# Altium schematic sheet CAN_Interface.SchDoc
size 431 x 279 mm; Organization: ORGANIZATION; Address1: ADDRESS 1; Address2: ADDRESS 2; Address3: ADDRESS 3; Address4: ADDRESS 4; Revision: -; SheetNumber: 2; SheetTotal: 5; ENG_APP_DATE: --/--/--; DSN_APP_DATE: --/--/--; CHK_APP_DATE: --/--/--
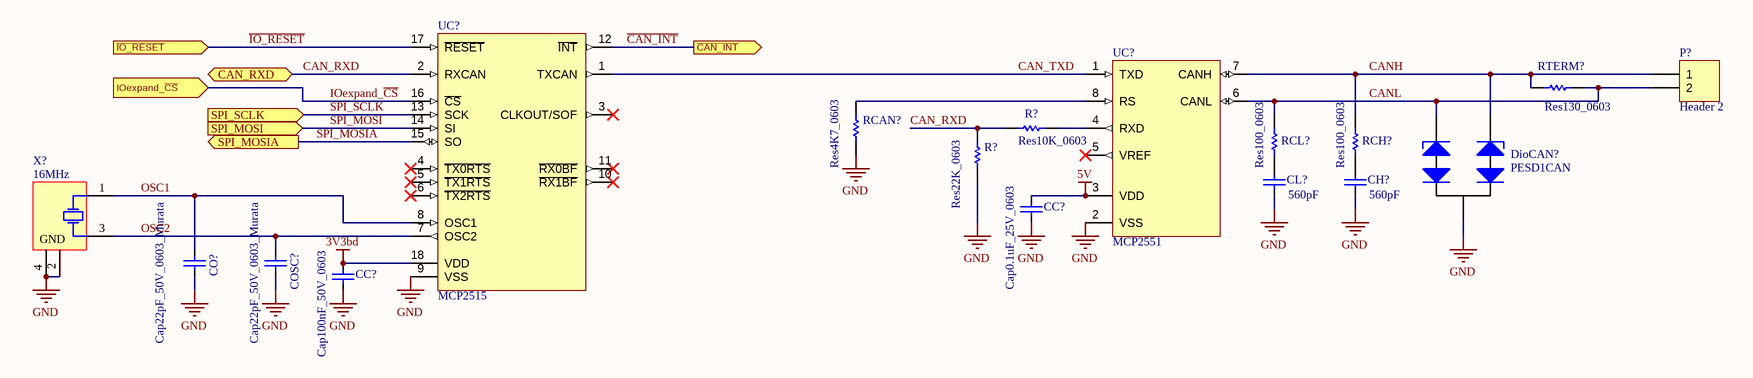
[diagram p0: CAN_Interface.SchDoc]

## Parts
(Parts that share a designator on the sheet are numbered #1, #2 ... from top to bottom, then left to right.)
CC?#1  Cap0.1uF_25V_0603  [0603C_L]
CC?#2  Cap100nF_50V_0603  [0603C_L]
CH?  value 560pF  [0603C_L]  (hidden comment: CAP General)
CL?  value 560pF  [0603C_L]  (hidden comment: CAP General)
CO?  Cap22pF_50V_0603_Murata  [0603C_L]
COSC?  Cap22pF_50V_0603_Murata  [0603C_L]
DioCAN?  PESD1CAN  [SOT323]
P?  Header 2  [HDR1X2]
R?#1  Res10K_0603  [0603_L]
R?#2  Res22K_0603  [0603_L]
RCAN?  Res4K7_0603  [0603_L]
RCH?  Res100_0603  [0603_L]
RCL?  Res100_0603  [0603_L]
RTERM?  Res130_0603  [0603_L]
UC?#1  MCP2515  [SOIC-SO18_M]
UC?#2  MCP2551  [SOIC-SN8_N]
X?  Frequency: 16MHz  [FP-ABM8-MFG]  (hidden comment: Crystal 4Pin)

## Ports
CAN_RXD (bidir), IOexpand_~{CS} (in), SPI_MOSI (in), SPI_MOSIA (out), SPI_SCLK (in), ~{CAN_INT} (out), ~{IO_RESET} (in)

## Nets
3V3bd: CC?#2.2 UC?#1.18(VDD)
5V: CC?#1.2 UC?#2.3(VDD)
GND: CC?#1.1 CC?#2.1 CH?.2 CL?.1 CO?.1 COSC?.1 DioCAN?.3 R?#2.1 RCAN?.1 UC?#1.9(VSS) UC?#2.2(VSS) X?.2(GND) X?.4(GND)
~{CAN_INT}: UC?#1.12(~{INT}) ; port ~{CAN_INT}
~{IO_RESET}: UC?#1.17(~{RESET}) ; port ~{IO_RESET}
CAN_RXD: R?#1.2 R?#2.2 UC?#1.2(RXCAN) ; port CAN_RXD
CAN_TXD: UC?#1.1(TXCAN) UC?#2.1(TXD)
CANH: DioCAN?.1(A) P?.1 RCH?.2 RTERM?.2 UC?#2.7(CANH)
CANL: DioCAN?.2(K) P?.2 RCL?.2 RTERM?.1 UC?#2.6(CANL)
IOexpand_~{CS}: UC?#1.16(~{CS}) ; port IOexpand_~{CS}
OSC1: CO?.2 UC?#1.8(OSC1) X?.1
OSC2: COSC?.2 UC?#1.7(OSC2) X?.3
SPI_MOSI: UC?#1.14(SI) ; port SPI_MOSI
SPI_MOSIA: UC?#1.15(SO) ; port SPI_MOSIA
SPI_SCLK: UC?#1.13(SCK) ; port SPI_SCLK
NetCH?_1: CH?.1 RCH?.1
NetCL?_2: CL?.2 RCL?.1
NetR?#1_1: R?#1.1 UC?#2.4(RXD)
NetRCAN?_2: RCAN?.2 UC?#2.8(RS)

Not connected (* = marked no-connect by the designer): UC?#1 3(CLKOUT/SOF)* 4(~{TX0RTS})* 5(~{TX1RTS})* 6(~{TX2RTS})* 10(~{RX1BF})* 11(~{RX0BF})*; UC?#2 5(VREF)*

## Notes on the sheet
- DWG. NO.
- REV.
- SHT.
- THIS DOCUMENT AND THE DATA DISCLOSED HEREIN OR HEREWITH IS THE PROPERTY OF ALTIUM LIMITED AND MAY BE FREELY DISTRIBUTED IN WHOLE. NO RIGHTS ARE RESERVED OR EXPRESS OR IMPLIED WARANTEE GIVEN.
- REVISION
- DESCRIPTION
- DATE
- APPROVED
- ENG:
- DSN:
- APPROVALS
- PROJECT REVISION:
- www.altium.com <http://www.altium.com>
- DOCUMENT REVISION:
- 92037, La Jolla
- USA
- Altium Ltd.
- 4225 Executive Square
- CHK:
- REFERENCE DOCUMENTS
- DESIGN ITEM:
- TITLE
- VARIANT
- BOM:
- FAB DWG:
- PCB DWG:
- ASSY DWG:
- SCALE:
- SIZE
- B
- CAGE CODE
- FILE NAME
- DWG NO.
- SHEET
- OF
- REV

## Library data of the parts
CC?#1 = CMP-00001-1: Value: 100nF; Voltage Rating: 25V; Case/Package: 0603
CC?#2 = CMP-00119-2: Ceramic Capacitor, Multilayer, Ceramic, 50V, 80% +Tol, 20% -Tol, Y5V, -82/+22% TC, 0.1uF, Surface Mount, 0603; Value: 100nF; Multilayer: Yes; Case/Package: 0603; Dielectric Material: Ceramic; Height: 0.8mm; Length: 1.6mm; Max Operating Temperature: 85°C; Min Operating Temperature: -30°C; Mounting Technology: Surface Mount; Packaging: Tape and Reel; Pins: 2; RoHS Compliant: Yes; Termination: Wraparound; Voltage Rating: 50V; Width: 0.8mm; Capacitor Type: Ceramic; JESD-609 Code: e3; Package Shape: Rectangular; Package Style: SMTMeter; Rated DC Voltage (URdc): 50V; Reach SVHC Compliant: Yes; Temperature Characteristics Code: Y5V; Terminal Finish: Nickel; Tolerance  (fill in as +-): 20%; Tolerance (fill in as +-): 80%
CH? CL? = CMP-00212-1: 560pF 25V 0603; Case/Package: 0603; Voltage Rating: 25V
CO? COSC? = CMP-00026-1: Ceramic Capacitor, Multilayer, Ceramic, 50V, 5% +Tol, 5% -Tol, C0G, 30ppm/Cel TC, 0.000022uF, Surface Mount, 0603; Value: 22pF; Multilayer: Yes; Case/Package: 0603; Pins: 2; Min Operating Temperature: -55°C; Max Operating Temperature: 125°C; Voltage Rating: 50V; Tolerance: 5%; Packaging: Tape and Reel; Length: 1.6mm; Height: 0.8mm; Width: 0.8mm; Dielectric Material: Ceramic; Mounting Technology: Surface Mount; RoHS Compliant: Yes; Termination: Wraparound; Capacitor Type: Ceramic; JESD-609 Code: e3; Package Shape: Rectangular; Package Style: SMTMeter; Rated DC Voltage (URdc): 50V; Reach SVHC Compliant: Yes; Temperature Characteristics Code: C0G; Terminal Finish: Nickel; Tolerance  (fill in as +-): 5%; Tolerance (fill in as +-): 5%
DioCAN? = CMP-00244-2: Trans Voltage Suppressor Diode, 150W, 24V V(RWM), Bidirectional, 2 Element, Silicon; Manufacturer: Nexperia USA Inc.; Diode Type: Fast Recovery; Design Item ID: PESD1CAN-UX; Source: WCT.SchLib
P? = CMP-00146-1: Header, 2-Pin; LatestRevisionDate: 17-Jul-2002; LatestRevisionNote: Re-released for DXP Platform.; Publisher: Altium Limited; Design Item ID: Header 2; Source: WCT.SchLib
R?#1 = CMP-00098-1: Manufacturer: Panasonic Electronic Components; Manufacturer Part Number: ERJ-3GEYJ102V; Resistance (Ohms): 10k; Tolerance: 5%; Power (Watts): 0.1W, 1/10W; Temperature Coefficient: ±200ppm/°C; RoHS: RoHS Compliant; Category: Resistors; Packaging: Cut Tape (CT); Part Status: Active; Composition: Thick Film; Features: Automotive AEC-Q200; Operating Temperature: -55°C ~ 155°C; Package / Case: 0603 (1608 Metric); Supplier Device Package: 0603; Size / Dimension: 0.063" L x 0.031" W (1.60mm x 0.80mm); Height: 0.022" (0.55mm); Number of Terminations: 2; Failure Rate: -; Design Item ID: Res10K_0603; Source: WCT.SchLib
R?#2 = CMP-00013-1: RES22K 0.5% 0603; Manufacturer: Yageo; Manufacturer Part Number: RT0603DRD0722KL; Power Rating: 100 mW; Temperature Coefficient: 25 PPM / C; Voltage Rating: 75V; Unit Weight: 0.000071 oz; Value: 22k; Stock 1: 39729; Pricing 1: 1=0.12, 10=0.104, 25=0.0716, 50=0.0558, 100=0.0399, 250=0.0311, 500=0.0247, 1000=0.0175 (USD); Product Category: Thin Film Resistors - SMD; RoHS: True; Tolerance: 0.5%; Case Code - mm: 1608; Operating Temperature Range: - 55 C to + 125 C; Series: RT; Packaging: Reel; Brand: Yageo; Height: 0.45 mm; Length: 1.6 mm; Package / Case: 0603 (1608 metric); Product: Thin Film Resistors SMD; Termination Style: SMD/SMT; Type: High Precision, High Stability; Width: 0.8 mm; ComponentLink1URL: https://datasheet.ciiva.com/12810/pyu-rt-1-to-0-05-rohs-l-4-12810773.pdf; ComponentLink1Description: https://datasheet.ciiva.com/12810/pyu-rt-1-to-0-05-rohs-l-4-12810773.pdf; Case/Package: 0603; Design Item ID: Res22K_0603; Source: WCT.SchLib
RCAN? = CMP-00016-1: Manufacturer: Yageo; Resistance (Ohms): 4.7k; Tolerance: 0.5%; Power (Watts): 0.1W, 1/10W; Temperature Coefficient: ±25ppm/°C; RoHS: RoHS Compliant; Category: Resistors; Stock 1: 28874; Pricing 1: 1=0.22, 10=0.184, 25=0.134, 100=0.0721, 250=0.05532, 500=0.04358, 1000=0.03018, 2500=0.02766 (USD); Packaging: Cut Tape (CT); Part Status: Active; Composition: Thin Film; Features: Moisture Resistant; Operating Temperature: -55°C ~ 155°C; Package / Case: 0603 (1608 Metric); Supplier Device Package: 0603; Size / Dimension: 0.063" L x 0.031" W (1.60mm x 0.80mm); Height: 0.022" (0.55mm); Number of Terminations: 2; Failure Rate: -; ComponentLink1URL: http://www.yageo.com/documents/recent/PYu-RT_1-to-0.05_RoHS_L_6.pdf; ComponentLink1Description: http://www.yageo.com/documents/recent/PYu-RT_1-to-0.05_RoHS_L_6.pdf; Design Item ID: Res4K7_0603; Source: WCT.SchLib
RCH? RCL? = CMP-00096-1: Manufacturer: Panasonic Electronic Components; Resistance (Ohms): 100; Tolerance: 5%; Power (Watts): 0.1W, 1/10W; Temperature Coefficient: ±200ppm/°C; RoHS: RoHS Compliant; Category: Resistors; Stock 1: 1335381; Pricing 1: 1=0.1, 50=0.0096, 100=0.0071, 250=0.00544, 500=0.00436, 1000=0.00321 (USD); Packaging: Cut Tape (CT); Part Status: Active; Composition: Thick Film; Features: Automotive AEC-Q200; Operating Temperature: -55°C ~ 155°C; Package / Case: 0603 (1608 Metric); Supplier Device Package: 0603; Size / Dimension: 0.063" L x 0.031" W (1.60mm x 0.80mm); Height: 0.022" (0.55mm); Number of Terminations: 2; Failure Rate: -; ComponentLink1URL: http://industrial.panasonic.com/www-cgi/jvcr13pz.cgi?E+PZ+3+AOA0001+ERJ3GEYJ102V+7+WW; ComponentLink1Description: http://industrial.panasonic.com/www-cgi/jvcr13pz.cgi?E+PZ+3+AOA0001+ERJ3GEYJ102V+7+WW; Design Item ID: Res100_0603; Source: WCT.SchLib
RTERM? = CMP-00199-1: Manufacturer: Panasonic Electronic Components; Resistance (Ohms): 100; Tolerance: 5%; Power (Watts): 0.1W, 1/10W; Temperature Coefficient: ±200ppm/°C; RoHS: RoHS Compliant; Category: Resistors; Stock 1: 1335381; Pricing 1: 1=0.1, 50=0.0096, 100=0.0071, 250=0.00544, 500=0.00436, 1000=0.00321 (USD); Packaging: Cut Tape (CT); Part Status: Active; Composition: Thick Film; Features: Automotive AEC-Q200; Operating Temperature: -55°C ~ 155°C; Package / Case: 0603 (1608 Metric); Supplier Device Package: 0603; Size / Dimension: 0.063" L x 0.031" W (1.60mm x 0.80mm); Height: 0.022" (0.55mm); Number of Terminations: 2; Failure Rate: -; ComponentLink1URL: http://industrial.panasonic.com/www-cgi/jvcr13pz.cgi?E+PZ+3+AOA0001+ERJ3GEYJ102V+7+WW; ComponentLink1Description: http://industrial.panasonic.com/www-cgi/jvcr13pz.cgi?E+PZ+3+AOA0001+ERJ3GEYJ102V+7+WW; Design Item ID: Res130_0603; Source: WCT.SchLib
UC?#1 = CMP-00190-1: Stand-Alone CAN Controller With SPI Interface, 18-Pin SOIC, Extended Temperature; Manufacturer: Microchip; Manufacturer Part Number: MCP2515-E/SO; Available Preview Images: 2D; RevisionNote: URLs added. DatasheetVersion updated.; DatasheetVersion: revF, Oct-2010; ComponentLink2Description: Datasheet; ComponentLink3Description: Package Specification; ComponentLink1Description: Manufacturer URL; PackageReference: SOIC-SO18; PackageDescription: 18-Lead Plastic Small Outline (SO) - Wide 7.50mm Body [SOIC]; PackageVersion: revBB, Aug-2009; ComponentLink1URL: http://www.microchip.com/; ComponentLink3URL: http://www.microchip.com/stellent/groups/techpub_sg/documents/packagingspec/en012702.pdf; ComponentLink2URL: http://ww1.microchip.com/downloads/en/DeviceDoc/21801f.pdf; Code_JEDEC: MS-013; Design Item ID: MCP2515-E/SO; Source: WCT.SchLib
UC?#2 = CMP-00229-1: High-Speed CAN Transceiver, 8-Pin SOIC, Extended Temperature; Manufacturer: Microchip; Manufacturer Part Number: MCP2551-E/SN; Available Preview Images: 2D; PackageReference: SOIC-SN8; Code_JEDEC: MS-012; ComponentLink1Description: Manufacturer URL; ComponentLink1URL: http://www.microchip.com/; PackageVersion: revBB, Aug-2009; ComponentLink3Description: Package Specification; Code_IPC: SOIC127P600-8; ComponentLink2URL: http://ww1.microchip.com/downloads/en/DeviceDoc/21667F.pdf; RevisionNote: URLs added. DatasheetVersion updated.; ComponentLink3URL: http://www.microchip.com/stellent/groups/techpub_sg/documents/packagingspec/en012702.pdf; DatasheetVersion: revF, Jul-2010; ComponentLink2Description: Datasheet; PackageDescription: 8-Lead Plastic Small Outline (SN) - Narrow, 3.90mm Body [SOIC]; Design Item ID: MCP2551-E/SN; Source: WCT.SchLib
X? = CMP-00010-2: Crystal 16MHz ±20ppm 18pF SMD-4 3.2mm x 2.5mm CSTCE16M0V53-R0 ABM8-16.000MHZ-B2-T; Series Resistance: 70R; ESR (Equivalent Series Resistance): 70; Frequency Stability: 50ppm; Tolerance: 20ppm; Max Operating Temperature: 70°C; Operating Frequency: 16MHz; Height: 0.031inch; REACH SVHC: No SVHC; Depth: 2.5mm; Package Quantity: 1000; Series: ABM8; Termination: SMD/SMT; Load Capacitance: 18pF; Frequency Tolerance: 20ppm; Min Operating Temperature: -20°C; Length: 3.2mm; Width: 2.5mm; Lead Free: Lead Free; Resistor Type: Ceramic; Radiation Hardening: No; Mount: Surface Mount; RoHS Compliant: Yes; Case/Package: CSMD; Packaging: Tape and Reel; Design Item ID: ABM8-16.000MHZ-B2-T; Pins: 4; Source: WCT.SchLib